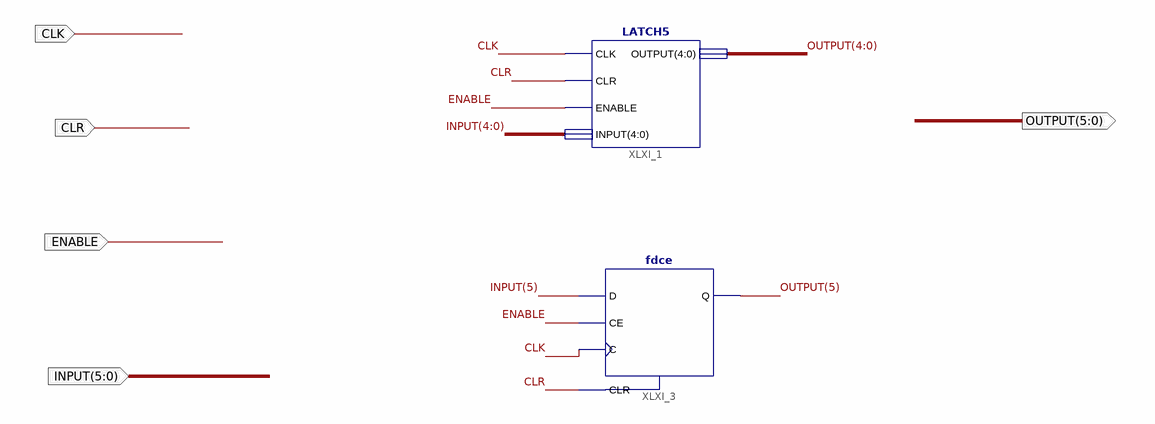
[diagram p0: schematic sheet 1]
// Xilinx ISE schematic LATCH6.sch (artix7) as structural Verilog: 2 symbols, 5 ports
module LATCH6 (
  input  CLK,
  input  CLR,
  input  ENABLE,
  input  [5:0] INPUT,
  output [5:0] OUTPUT
);

  LATCH5 XLXI_1 (.CLK(CLK), .CLR(CLR), .ENABLE(ENABLE), .INPUT(INPUT[4:0]), .OUTPUT(OUTPUT[4:0]));
  fdce XLXI_3 (.C(CLK), .CE(ENABLE), .CLR(CLR), .D(INPUT[5]), .Q(OUTPUT[5]));
endmodule
